# Altium schematic sheet CAN_IO.SchDoc: Rechard Topping
size 431 x 279 mm; Date: 19-02-2023; ApprovedBy: Rechard Nabo; CheckedBy: Rechard Nabo; Author: Rechard Nabo; CompanyName: Rechard Nabo; DrawnBy: Rechard Nabo; Engineer: Rechard Nabo; Organization: ORGANIZATION; Address1: ADDRESS 1; Address2: ADDRESS 2; Address3: ADDRESS 3; Address4: ADDRESS 4; Revision: -; SheetNumber: 2; SheetTotal: 5; Title2: Rechard Topping; Project: Rechard Topping; ENG_APP_DATE: 19-02-2023; DSN_APP_DATE: 19-02-2023; CHK_APP_DATE: 19-02-2023
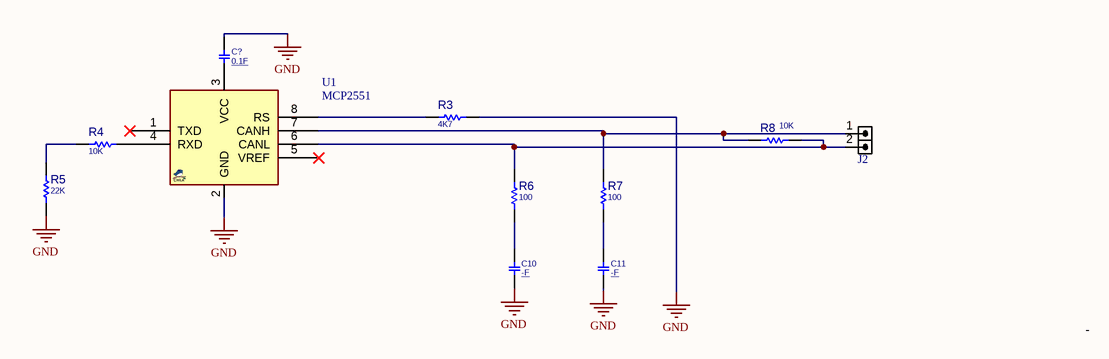
[diagram p0: CAN_IO.SchDoc]

## Parts
C10  -F  [C0805]
C11  -F  [C0805]
C?  0.1F  [C0805]
J2  HDRM2  [HDR_M_1X2]  (value not drawn)
R3  4K7  [R0805]
R4  10K  [R0805]
R5  22K  [R0805]
R6  100  [R0805]
R7  100  [R0805]
R8  10K  [R0805]
U1  MCP2551  [SO_8]

## Nets
GND: C10.1 C11.1 C?.2 R3.2 R5.1 U1.2(GND)
NetC10_2: C10.2 R6.1
NetC11_2: C11.2 R7.1
NetC?_1: C?.1 U1.3(VCC)
NetJ2_1: J2.1 R7.2 R8.2 U1.7(CANH)
NetJ2_2: J2.2 R6.2 R8.1 U1.6(CANL)
NetR3_1: R3.1 U1.8(RS)
NetR4_1: R4.1 R5.2
NetR4_2: R4.2 U1.4(RXD)

Not connected (* = marked no-connect by the designer): U1 1(TXD)* 5(VREF)*

## Notes on the sheet
- -
- DWG. NO.
- REV.
- SHT.
- THIS DOCUMENT AND THE DATA DISCLOSED HEREIN OR HEREWITH IS THE PROPERTY OF ALTIUM LIMITED AND MAY BE FREELY DISTRIBUTED IN WHOLE. NO RIGHTS ARE RESERVED OR EXPRESS OR IMPLIED WARANTEE GIVEN.
- REVISION
- DESCRIPTION
- DATE
- APPROVED
- ENG:
- APPROVALS
- PROJECT
- DSN:
- CHK:
- REFERENCE DOCUMENTS
- PROJECT REVISION:
- TITLE
- DOCUMENT REVISION:
- DESIGN ITEM:
- BOM:
- FAB DWG:
- PCB DWG:
- ASSY DWG:
- SCALE:
- SIZE
- B
- CAGE CODE
- FILE NAME
- DWG NO.
- SHEET
- OF
- REV

## Library data of the parts
C10 C11 C? = CAP_SMD_MLCC_0805: CAP, MLCC, -F, -V, MATERIAL, -%, 0201; PARAM: -, -%; MANF_P#: MANF_PART#; PRICE: 100= 1$; MANF: -; PARAM2: -V; ASSEMBLY: ASSEMBLY
  C10 C11: VALUE: -F
  C?: VALUE: 0.1F
J2 = HDR_M_1X2: CONN, HEADER, Male, pitch: 2.54mm, 2POS; VALUE: HDRM2
R3-R8 = RES_SMD_0805: RESISTOR, SMD; PARAM: -W; DESC: DESCRIPTION; DIST#: MOUSER; PARAM2: 1%; MANF_P#: -; MANF: -; ASSEMBLY: ASSEMBLY; PRICE: 100= 0.5$
  R3: VALUE: 4K7
  R4 R8: VALUE: 10K
  R5: VALUE: 22K
  R6 R7: VALUE: 100
U1 = MCP2551_SOP8: Can, Transceiver, High Speed, 5V (VDD); MANF: MICROCHIP; MANF_P#: MCP2551-I/SN; PARAM2: 5V (VDD), 12/24V; PRICE: 3000toman@PAYA; PARAM: PARAM; VALUE: MCP2551